# Altium schematic sheet IO.SchDoc
size A4
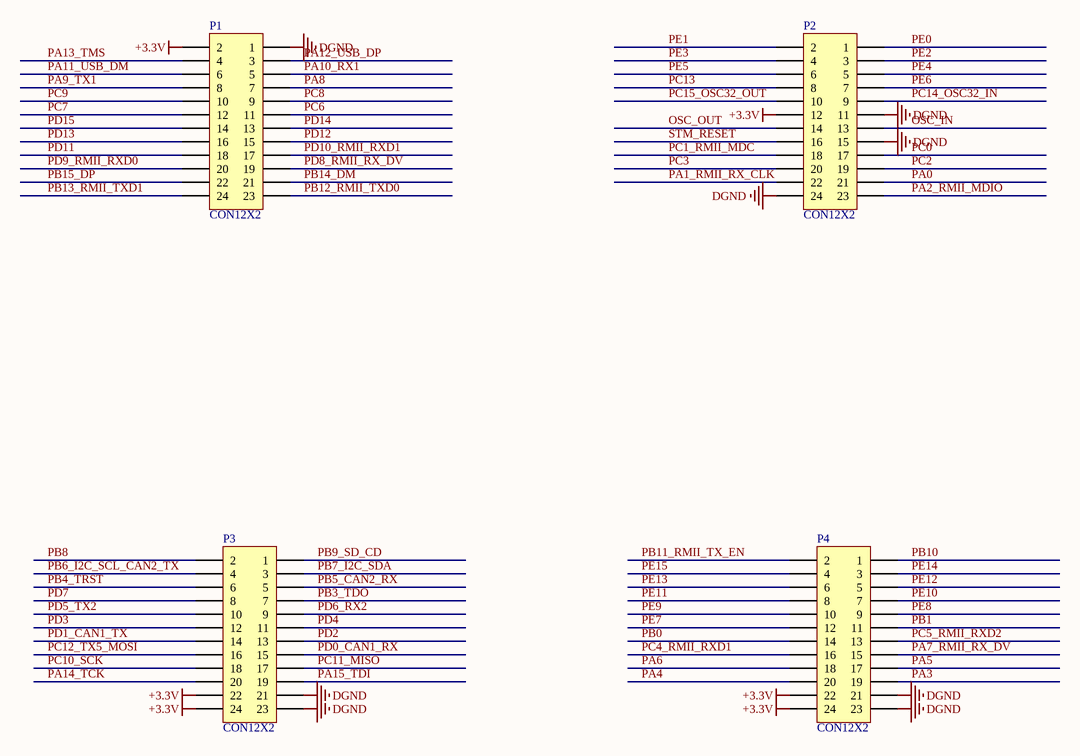
[diagram p0: IO.SchDoc]

## Parts
P1  CON12X2  [HDR2X12-2.54MM]
P2  CON12X2  [HDR2X12-2.54MM]
P3  CON12X2  [HDR2X12-2.54MM]
P4  CON12X2  [HDR2X12-2.54MM]

## Nets
+3.3V: P1.2 P2.12 P3.22 P3.24 P4.22 P4.24
DGND: P1.1 P2.11 P2.15 P2.24 P3.21 P3.23 P4.21 P4.23
OSC_IN: P2.13
OSC_OUT: P2.14
PA0: P2.21
PA1_RMII_RX_CLK: P2.22
PA2_RMII_MDIO: P2.23
PA3: P4.19
PA4: P4.20
PA5: P4.17
PA6: P4.18
PA7_RMII_RX_DV: P4.15
PA8: P1.7
PA9_TX1: P1.8
PA10_RX1: P1.5
PA11_USB_DM: P1.6
PA12_USB_DP: P1.3
PA13_TMS: P1.4
PA14_TCK: P3.20
PA15_TDI: P3.19
PB0: P4.14
PB1: P4.11
PB3_TDO: P3.7
PB4_TRST: P3.6
PB5_CAN2_RX: P3.5
PB6_I2C_SCL_CAN2_TX: P3.4
PB7_I2C_SDA: P3.3
PB8: P3.2
PB9_SD_CD: P3.1
PB10: P4.1
PB11_RMII_TX_EN: P4.2
PB12_RMII_TXD0: P1.23
PB13_RMII_TXD1: P1.24
PB14_DM: P1.21
PB15_DP: P1.22
PC0: P2.17
PC1_RMII_MDC: P2.18
PC2: P2.19
PC3: P2.20
PC4_RMII_RXD1: P4.16
PC5_RMII_RXD2: P4.13
PC6: P1.11
PC7: P1.12
PC8: P1.9
PC9: P1.10
PC10_SCK: P3.18
PC11_MISO: P3.17
PC12_TX5_MOSI: P3.16
PC13: P2.8
PC14_OSC32_IN: P2.9
PC15_OSC32_OUT: P2.10
PD0_CAN1_RX: P3.15
PD1_CAN1_TX: P3.14
PD2: P3.13
PD3: P3.12
PD4: P3.11
PD5_TX2: P3.10
PD6_RX2: P3.9
PD7: P3.8
PD8_RMII_RX_DV: P1.19
PD9_RMII_RXD0: P1.20
PD10_RMII_RXD1: P1.17
PD11: P1.18
PD12: P1.15
PD13: P1.16
PD14: P1.13
PD15: P1.14
PE0: P2.1
PE1: P2.2
PE2: P2.3
PE3: P2.4
PE4: P2.5
PE5: P2.6
PE6: P2.7
PE7: P4.12
PE8: P4.9
PE9: P4.10
PE10: P4.7
PE11: P4.8
PE12: P4.5
PE13: P4.6
PE14: P4.3
PE15: P4.4
STM_RESET: P2.16

## Library data of the parts
P1-P4 = CON12X2: Header, 12-Pin, Dual row; LatestRevisionDate: 17-Jul-2002; LatestRevisionNote: Re-released for DXP Platform.; Publisher: Altium Limited